# EasyEDA Pro project split-keyboard.epro, schematic Left bottom
Board Name: Left bottom; Create Date: 2025-12-19; Page Name: P1; Project Name: split-keyboard-2025; Schematic Name: Schematic1; Update Date: 2025-12-19; Company: EasyEDA.com; Page Size: A4; Version: V1.0
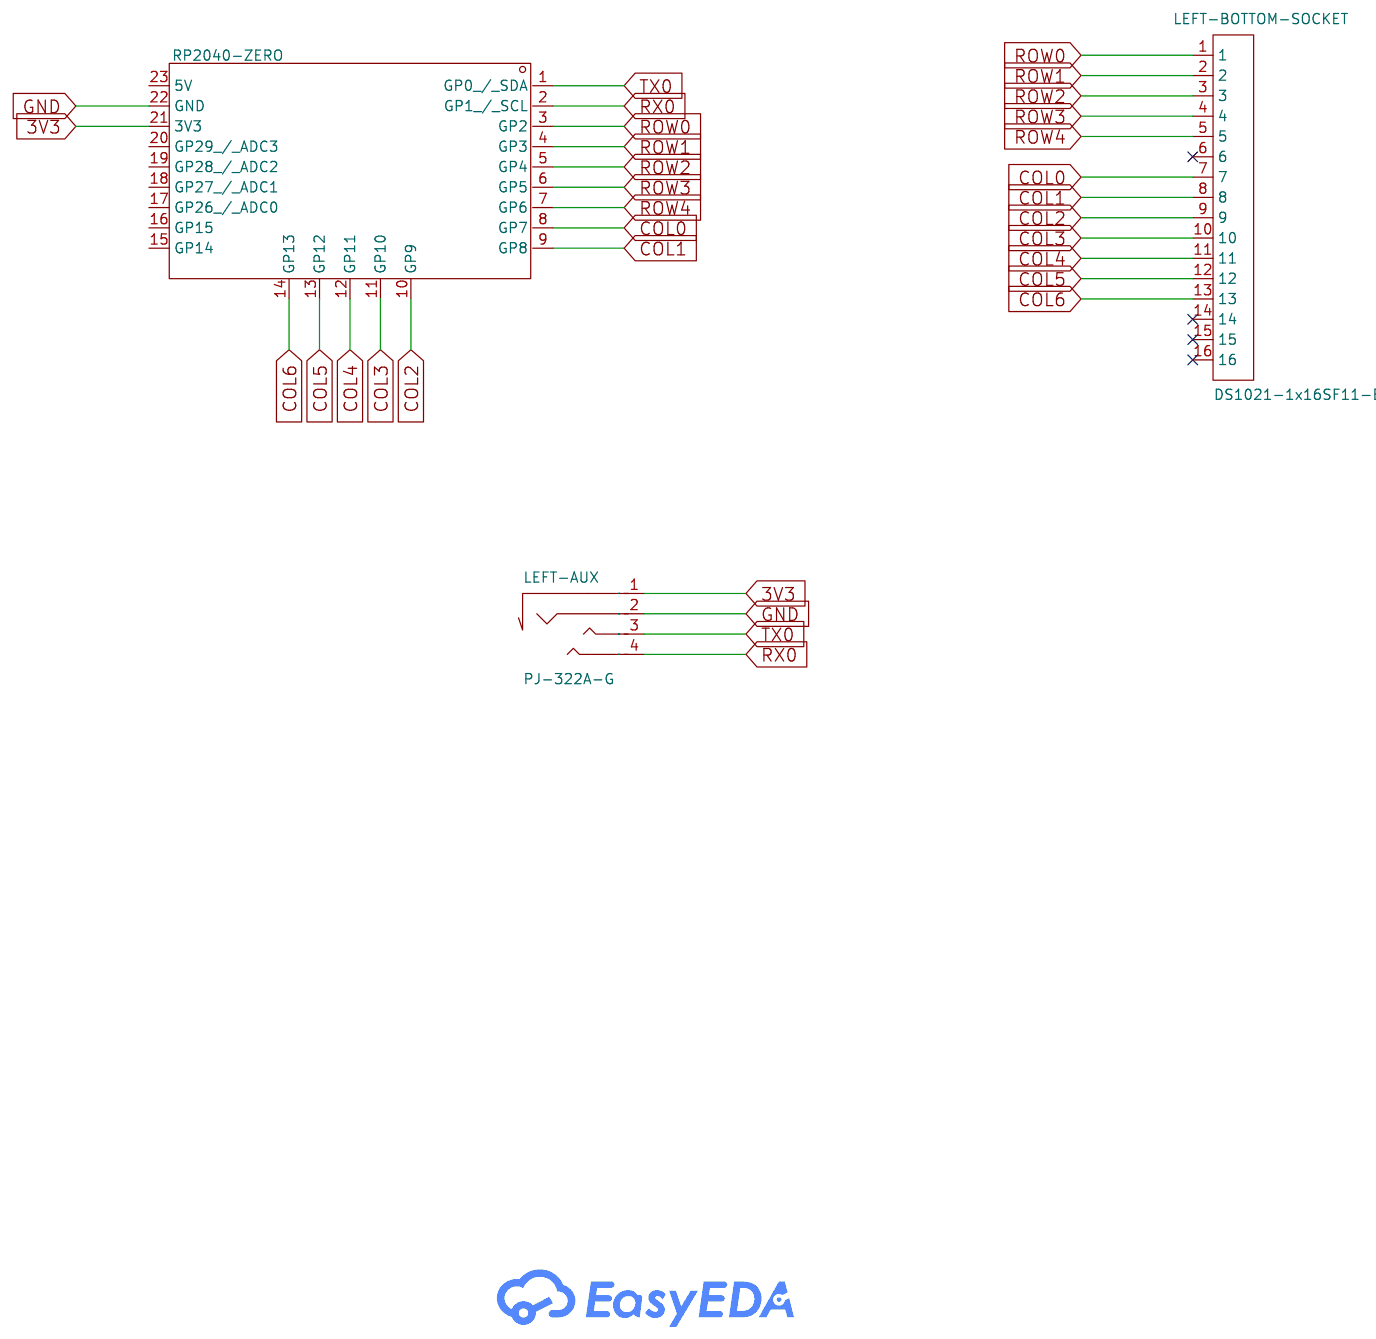
[diagram p0: schematic sheet]

## Parts
LEFT-AUX  PJ-322A-G  [AUDIO-TH_PJ-322A-Y]
LEFT-BOTTOM-SOCKET  DS1021-1x16SF11-B  [HDR-TH_16P-P2.54-V-M]
RP2040-ZERO  -  [RP2040-Zero]

## Library data of the parts
LEFT-AUX = PJ-322A-G: Connector Type:3.5mm Headphone Jack Current Rating:500mA Voltage Rating (Max):30V Operating Temperature:-20℃~+70℃ Operating Temperature:-20℃~+70℃; LCSC Part Name: 绿色 3.5mm耳机座; Supplier Part: C2885040; Manufacturer: XKB Connection(中国星坤); Supplier Footprint: 插件; Datasheet: https://item.szlcsc.com/datasheet/PJ-322A-G/3095532.html; Supplier: LCSC; Connector Type: 3.5mm Headphone Jack; Current Rating: 500mA; Voltage Rating (Max): 30V; Operating Temperature: -20℃~+70℃
LEFT-BOTTOM-SOCKET = DS1021-1x16SF11-B: Pin Structure:1x16P Pitch:2.54mm Circluar Pins/Square Pins:Pin Header Mounting Type:Through Hole Number of Rows:1 Number of Pins:16P Current Rating:3A Voltage Rating (Max):250V Contact Material:Copper Alloy Contact Plating:Gold Operating Temperature:-40℃~; LCSC Part Name: 1x16P 间距:2.54mm 方针 直插; Supplier Part: C7430372; Manufacturer: CONNFLY; Supplier Footprint: 插件,P=2.54mm; JLCPCB Part Class: Extended Part; Datasheet: https://item.szlcsc.com/datasheet/DS1021-1x16SF11-B/8430025.html; Supplier: LCSC; Pin Structure: 1x16P; Pitch: 2.54mm; Circluar Pins/Square Pins: Pin Header; Mounting Type: Through Hole; Number of Rows: 1; Number of Pins: 16P; Current Rating: 3A; Voltage Rating (Max): 250V; Contact Material: Copper Alloy; Contact Plating: Gold; Operating Temperature: -40℃~+105℃; Color: Black
RP2040-ZERO = RP2040-Zero

## Nets
3V3: LEFT-AUX.1 RP2040-ZERO.21(3V3)
GND: LEFT-AUX.2 RP2040-ZERO.22(GND)
COL0: LEFT-BOTTOM-SOCKET.7 RP2040-ZERO.8(GP7)
COL1: LEFT-BOTTOM-SOCKET.8 RP2040-ZERO.9(GP8)
COL2: LEFT-BOTTOM-SOCKET.9 RP2040-ZERO.10(GP9)
COL3: LEFT-BOTTOM-SOCKET.10 RP2040-ZERO.11(GP10)
COL4: LEFT-BOTTOM-SOCKET.11 RP2040-ZERO.12(GP11)
COL5: LEFT-BOTTOM-SOCKET.12 RP2040-ZERO.13(GP12)
COL6: LEFT-BOTTOM-SOCKET.13 RP2040-ZERO.14(GP13)
ROW0: LEFT-BOTTOM-SOCKET.1 RP2040-ZERO.3(GP2)
ROW1: LEFT-BOTTOM-SOCKET.2 RP2040-ZERO.4(GP3)
ROW2: LEFT-BOTTOM-SOCKET.3 RP2040-ZERO.5(GP4)
ROW3: LEFT-BOTTOM-SOCKET.4 RP2040-ZERO.6(GP5)
ROW4: LEFT-BOTTOM-SOCKET.5 RP2040-ZERO.7(GP6)
RX0: LEFT-AUX.4 RP2040-ZERO.2(GP1 / SCL)
TX0: LEFT-AUX.3 RP2040-ZERO.1(GP0 / SDA)

Not connected (* = marked no-connect by the designer): LEFT-BOTTOM-SOCKET 6* 14* 15* 16*; RP2040-ZERO 15(GP14) 16(GP15) 17(GP26 / ADC0) 18(GP27 / ADC1) 19(GP28 / ADC2) 20(GP29 / ADC3) 23(5V)
